# Altium schematic sheet Connectors.SchDoc
size A4
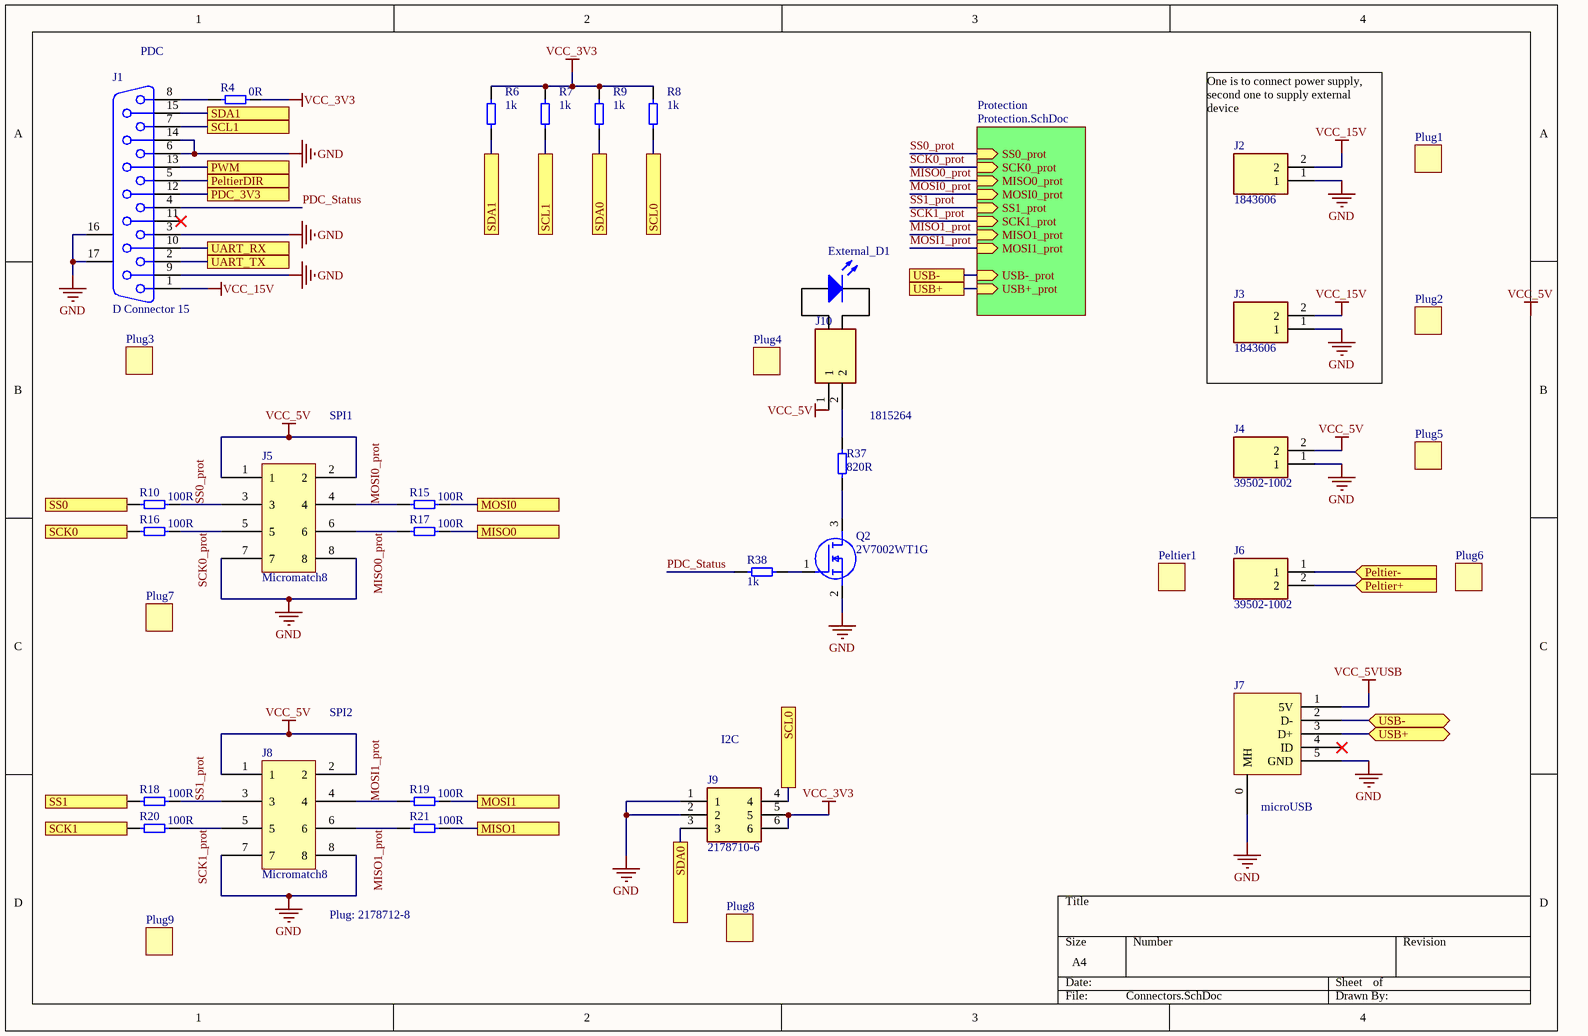
[diagram p0: Connectors.SchDoc]

## Parts
External_D1  LED0  (value not drawn)
J1  D Connector 15  [DSUB_15_D15S33E4GV00LF]
J2  1843606  [SHDR2W80P0X350_1X2_840X725X920P]
J3  1843606  [SHDR2W80P0X350_1X2_840X725X920P]
J4  39502-1002  [SHDR2W110P0X350_1X2_840X920X690P]
J5  Micromatch8  [micromatch8]
J6  39502-1002  [SHDR2W110P0X350_1X2_840X920X690P]
J7  microUSB  [microUSB_molex_476540001]
J8  Micromatch8  [micromatch8]
J9  2178710-6  [21787106]
J10  1815264  [1815264]
Peltier1  plug  (value not drawn)
Plug1  plug  (value not drawn)
Plug2  plug  (value not drawn)
Plug3  plug  (value not drawn)
Plug4  plug  (value not drawn)
Plug5  plug  (value not drawn)
Plug6  plug  (value not drawn)
Plug7  plug  (value not drawn)
Plug8  plug  (value not drawn)
Plug9  plug  (value not drawn)
Q2  2V7002WT1G  [SOT65P220X100-3N]
R4  0R  [0603-Resistor]
R6  1k  [0603-Resistor]
R7  1k  [0603-Resistor]
R8  1k  [0603-Resistor]
R9  1k  [0603-Resistor]
R10  100R  [0603-Resistor]
R15  100R  [0603-Resistor]
R16  100R  [0603-Resistor]
R17  100R  [0603-Resistor]
R18  100R  [0603-Resistor]
R19  100R  [0603-Resistor]
R20  100R  [0603-Resistor]
R21  100R  [0603-Resistor]
R37  820R  [0603-Resistor]
R38  1k  [0603-Resistor]

## Sub-sheets
Protection = Protection.SchDoc: SS0_prot (in), SCK0_prot (in), MISO0_prot (in), MOSI0_prot (in), SS1_prot (in), SCK1_prot (in), MISO1_prot (in), MOSI1_prot (in), USB-_prot (in), USB+_prot (in)

## Ports
MISO0, MISO1, MOSI0, MOSI1, PDC_3V3, Peltier+ (in), Peltier- (in), PeltierDIR, PWM, SCK0, SCK1, SCL0, SCL1, SDA0, SDA1, SS0, SS1, UART_RX, UART_TX, USB+, USB+ (bidir), USB-, USB- (bidir)

## Nets
GND: J1.3 J1.6 J1.9 J1.14 J1.16(MH1) J1.17(MH2) J2.1 J3.1 J4.1 J5.7 J5.8 J7.0(MH) J7.5(GND) J8.7 J8.8 J9.1 J9.2 Q2.2(S)
VCC_3V3: J9.5 J9.6 R4.1 R6.2 R7.2 R8.2 R9.2
VCC_5V: J4.2 J5.1 J5.2 J8.1 J8.2 J10.1
VCC_5VUSB: J7.1(5V)
VCC_15V: J1.1 J2.2 J3.2
MISO0: R17.1 ; port MISO0
MISO0_prot: J5.6 R17.2 ; sheet Protection/MISO0_prot
MISO1: R21.1 ; port MISO1
MISO1_prot: J8.6 R21.2 ; sheet Protection/MISO1_prot
MOSI0: R15.1 ; port MOSI0
MOSI0_prot: J5.4 R15.2 ; sheet Protection/MOSI0_prot
MOSI1: R19.1 ; port MOSI1
MOSI1_prot: J8.4 R19.2 ; sheet Protection/MOSI1_prot
PDC_3V3: J1.12 ; port PDC_3V3
PDC_Status: J1.4 R38.2
Peltier+: J6.2 ; port Peltier+
Peltier-: J6.1 ; port Peltier-
PeltierDIR: J1.5 ; port PeltierDIR
PWM: J1.13 ; port PWM
SCK0: R16.2 ; port SCK0
SCK0_prot: J5.5 R16.1 ; sheet Protection/SCK0_prot
SCK1: R20.2 ; port SCK1
SCK1_prot: J8.5 R20.1 ; sheet Protection/SCK1_prot
SCL0: J9.4 R8.1 ; port SCL0
SCL1: J1.7 R7.1 ; port SCL1
SDA0: J9.3 R9.1 ; port SDA0
SDA1: J1.15 R6.1 ; port SDA1
SS0: R10.2 ; port SS0
SS0_prot: J5.3 R10.1 ; sheet Protection/SS0_prot
SS1: R18.2 ; port SS1
SS1_prot: J8.3 R18.1 ; sheet Protection/SS1_prot
UART_RX: J1.10 ; port UART_RX
UART_TX: J1.2 ; port UART_TX
USB+: J7.3(D+) ; port USB+, sheet Protection/USB+_prot
USB-: J7.2(D-) ; port USB-, sheet Protection/USB-_prot
NetJ1_8: J1.8 R4.2
NetJ10_2: J10.2 R37.1
NetQ2_1: Q2.1(G) R38.1
NetQ2_3: Q2.3(D) R37.2

Not connected (* = marked no-connect by the designer): External_D1 1(A) 2(K); J1 11*; J7 4(ID)*

## Notes on the sheet
- (near J1) PDC
- One is to connect power supply, second one to supply external device
- SPI1
- SPI2
- I2C
- Plug: 2178712-8
- Labels drawn without touching a wire or pin: VCC_5V

## Library data of the parts
External_D1 = LED0: External panel mounted LED; Manufacturer: Dialight; Manufacturer Nr: 559-5201-007F
J1 = D Connector 15: Receptacle Assembly, 15 Position, Right Angle; Manufacturer: Amphenol ICC; Manufacturer Nr: D15S33E4GV00LF; PackageDocument: O; Positions: 15; Published: 15-Jun-2001; LatestRevisionDate: 17-Jul-2002; LatestRevisionNote: Re-released for DXP Platform.; DatasheetDocument: 1-Sep-99; PackageReference: 788757; Publisher: Altium Limited; Orientation: Right Angle; Gender: Receptacle
J2 J3 = 1843606: Connector; Manufacturer_Name: Phoenix Contact; Allied_Number: 70054529; Datasheet Link: https://componentsearchengine.com/Datasheets/2/1843606.pdf; Height: 9.2mm; Manufacturer_Part_Number: 1843606; Mouser Part Number: 651-1843606; Mouser Price/Stock: https://www.mouser.com/Search/Refine.aspx?Keyword=651-1843606; RS Part Number: 8042194; RS Price/Stock: http://uk.rs-online.com/web/p/products/8042194; Allied Price/Stock: https://www.alliedelec.com/phoenixcontact-1843606/70054529/
J4 J6 = 39502-1002: Connector; Manufacturer_Name: Molex; Allied_Number: E5293141; Datasheet Link: https://www.molex.com/webdocs/datasheets/pdf/en-us/0395021002_TERMINAL_BLOCKS.pdf; Height: 6.9mm; Manufacturer_Part_Number: 39502-1002; Mouser Part Number: 538-39502-1002; Mouser Price/Stock: https://www.mouser.com/Search/Refine.aspx?Keyword=538-39502-1002; Allied Price/Stock: https://www.alliedelec.com/molex-incorporated-39502-1002/E5293141/
J5 J8 = Micromatch8: Manufacturer: TE Connectivity; Manufacturer Nr: 2178710-8
J7 = microUSB_molex_476540001: Molex 476540001; Manufacturer: Molex; Manufacturer Nr: 476540001
J9 = 2178710-6: Connector; Manufacturer_Name: TE Connectivity; Datasheet Link: https://www.te.com/commerce/DocumentDelivery/DDEController?Action=showdoc&DocId=Customer+Drawing%7F2178710%7FA%7Fpdf%7FEnglish%7FENG_CD_2178710_A_pdf_c-2178710_drw.pdf%7F2178710-6; Height: 4.2mm; Manufacturer_Part_Number: 2178710-6; Mouser Part Number: 571-2178710-6; Mouser Price/Stock: https://www.mouser.com/Search/Refine.aspx?Keyword=571-2178710-6; RS Part Number: 8475468P; RS Price/Stock: http://uk.rs-online.com/web/p/products/8475468P
J10 = 1815264: Connector; Manufacturer_Name: Phoenix Contact; Allied_Number: 70282220; Datasheet Link: https://www.phoenixcontact.com/online/portal/in?uri=pxc-oc-itemdetail:pid=1815264&library=inen&tab=1; Height: 7.65mm; Manufacturer_Part_Number: 1815264; Mouser Part Number: 651-1815264; Mouser Price/Stock: https://www.mouser.com/Search/Refine.aspx?Keyword=651-1815264; RS Part Number: 8020138; RS Price/Stock: http://uk.rs-online.com/web/p/products/8020138; Allied Price/Stock: https://www.alliedelec.com/phoenixcontact-1815264/70282220/
Peltier1 = plug: Manufacturer: Laird Thermal Systems; Manufacturer Nr: 430848-504
Plug1 Plug2 = plug: Manufacturer: Phoenix Contact; Manufacturer Nr: 1952267
Plug3 = plug: Manufacturer: Amphenol; Manufacturer Nr: L17DAFRA15P
Plug4 = plug: Manufacturer: Phoenix Contact; Manufacturer Nr: 1709457
Plug5 Plug6 = plug: Manufacturer: Molex; Manufacturer Nr: 39500-0002
Plug7 Plug9 = plug: Manufacturer: TE Connectivity; Manufacturer Nr: 2178712-8
Plug8 = plug: Manufacturer: TE Connectivity; Manufacturer Nr: 2178712-6
Q2 = 2V7002WT1G: MOSFET (N-Channel); Manufacturer_Name: ON Semiconductor; Datasheet Link: http://www.onsemi.com/pub/Collateral/2N7002W-D.PDF; Height: 1mm; Manufacturer_Part_Number: 2V7002WT1G; Mouser Part Number: 863-2V7002WT1G; Mouser Price/Stock: https://www.mouser.com/Search/Refine.aspx?Keyword=863-2V7002WT1G; RS Part Number: 7905246P; RS Price/Stock: http://uk.rs-online.com/web/p/products/7905246P
R4 R6-R10 R15-R21 R38 = R0603: Resistor; Part Number: R0603; Pin Count: 2; Manufacturer: *; Package: 0603; ManufacturerNr: *
  R4: Value: 0R
  R6-R9 R38: Value: 1k
  R10 R15-R21: Value: 100R
R37 = R0603: Resistor; Part Number: R0603; Value: 420R; Pin Count: 2; Manufacturer: *; Package: 0603; ManufacturerNr: *